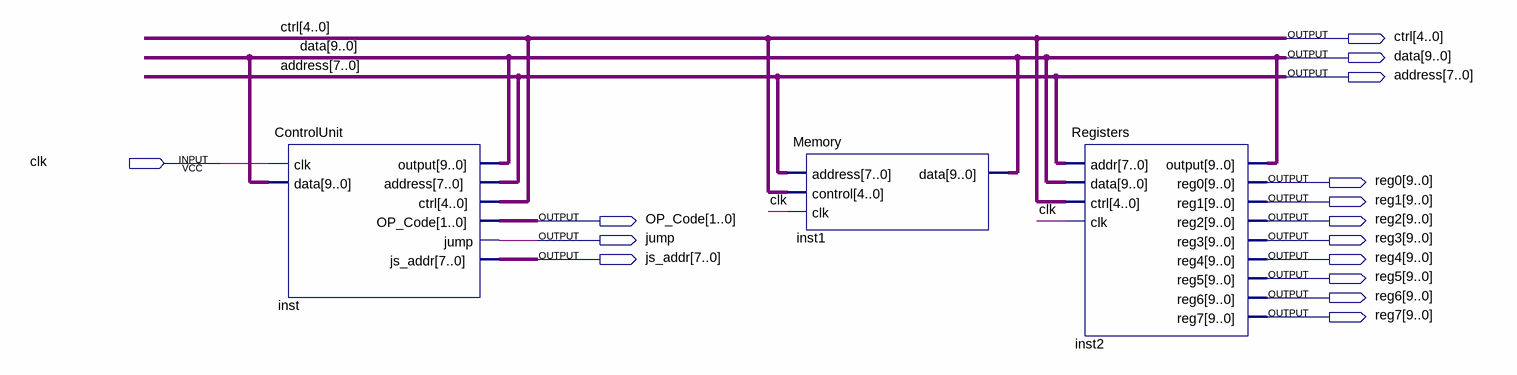
[diagram p0: schematic sheet]
// Quartus schematic lab4.bdf as structural Verilog: 3 symbols, 15 pins
module lab4 (
  input  clk,
  output [4:0] ctrl,
  output [9:0] data,
  output [7:0] address,
  output [9:0] reg0,
  output [9:0] reg1,
  output [1:0] OP_Code,
  output [9:0] reg2,
  output jump,
  output [9:0] reg3,
  output [7:0] js_addr,
  output [9:0] reg4,
  output [9:0] reg5,
  output [9:0] reg6,
  output [9:0] reg7
);

  ControlUnit inst (
    .clk(clk), .data(data), .\output (data), .address(address), .ctrl(ctrl), .OP_Code(OP_Code), .jump(jump),
    .js_addr(js_addr));
  Memory inst1 (.address(address), .control(ctrl), .clk(clk), .data(data));
  Registers inst2 (
    .addr(address), .data(data), .ctrl(ctrl), .clk(clk), .\output (data), .reg0(reg0), .reg1(reg1),
    .reg2(reg2), .reg3(reg3), .reg4(reg4), .reg5(reg5), .reg6(reg6), .reg7(reg7));
endmodule
